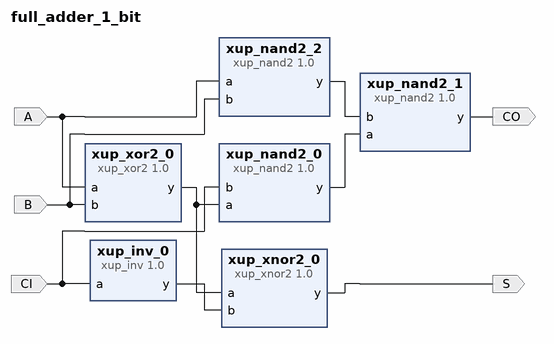
[diagram p0: block diagram of the top level]
# Vivado block design full_adder_1_bit, xc7a35tcpg236-1, Vivado 2016.3
create_bd_design full_adder_1_bit

create_bd_port -dir I A
create_bd_port -dir I B
create_bd_port -dir I CI
create_bd_port -dir O S
create_bd_port -dir O CO

create_bd_cell -type ip -vlnv xilinx.com:xup:xup_xor2:1.0 xup_xor2_0
create_bd_cell -type ip -vlnv xilinx.com:xup:xup_nand2:1.0 xup_nand2_0
create_bd_cell -type ip -vlnv xilinx.com:xup:xup_nand2:1.0 xup_nand2_1
create_bd_cell -type ip -vlnv xilinx.com:xup:xup_nand2:1.0 xup_nand2_2
create_bd_cell -type ip -vlnv xilinx.com:xup:xup_inv:1.0 xup_inv_0
create_bd_cell -type ip -vlnv xilinx.com:xup:xup_xnor2:1.0 xup_xnor2_0

# ---- connections ----

connect_bd_net [get_bd_ports A] [get_bd_pins xup_xor2_0/a] [get_bd_pins xup_nand2_2/a]
connect_bd_net [get_bd_ports B] [get_bd_pins xup_xor2_0/b] [get_bd_pins xup_nand2_2/b]
connect_bd_net [get_bd_pins xup_nand2_2/y] [get_bd_pins xup_nand2_1/b]
connect_bd_net [get_bd_pins xup_xor2_0/y] [get_bd_pins xup_nand2_0/a] [get_bd_pins xup_xnor2_0/a]
connect_bd_net [get_bd_pins xup_nand2_0/y] [get_bd_pins xup_nand2_1/a]
connect_bd_net [get_bd_pins xup_nand2_1/y] [get_bd_ports CO]
connect_bd_net [get_bd_ports CI] [get_bd_pins xup_nand2_0/b] [get_bd_pins xup_inv_0/a]
connect_bd_net [get_bd_pins xup_xnor2_0/y] [get_bd_ports S]
connect_bd_net [get_bd_pins xup_inv_0/y] [get_bd_pins xup_xnor2_0/b]

validate_bd_design
save_bd_design
